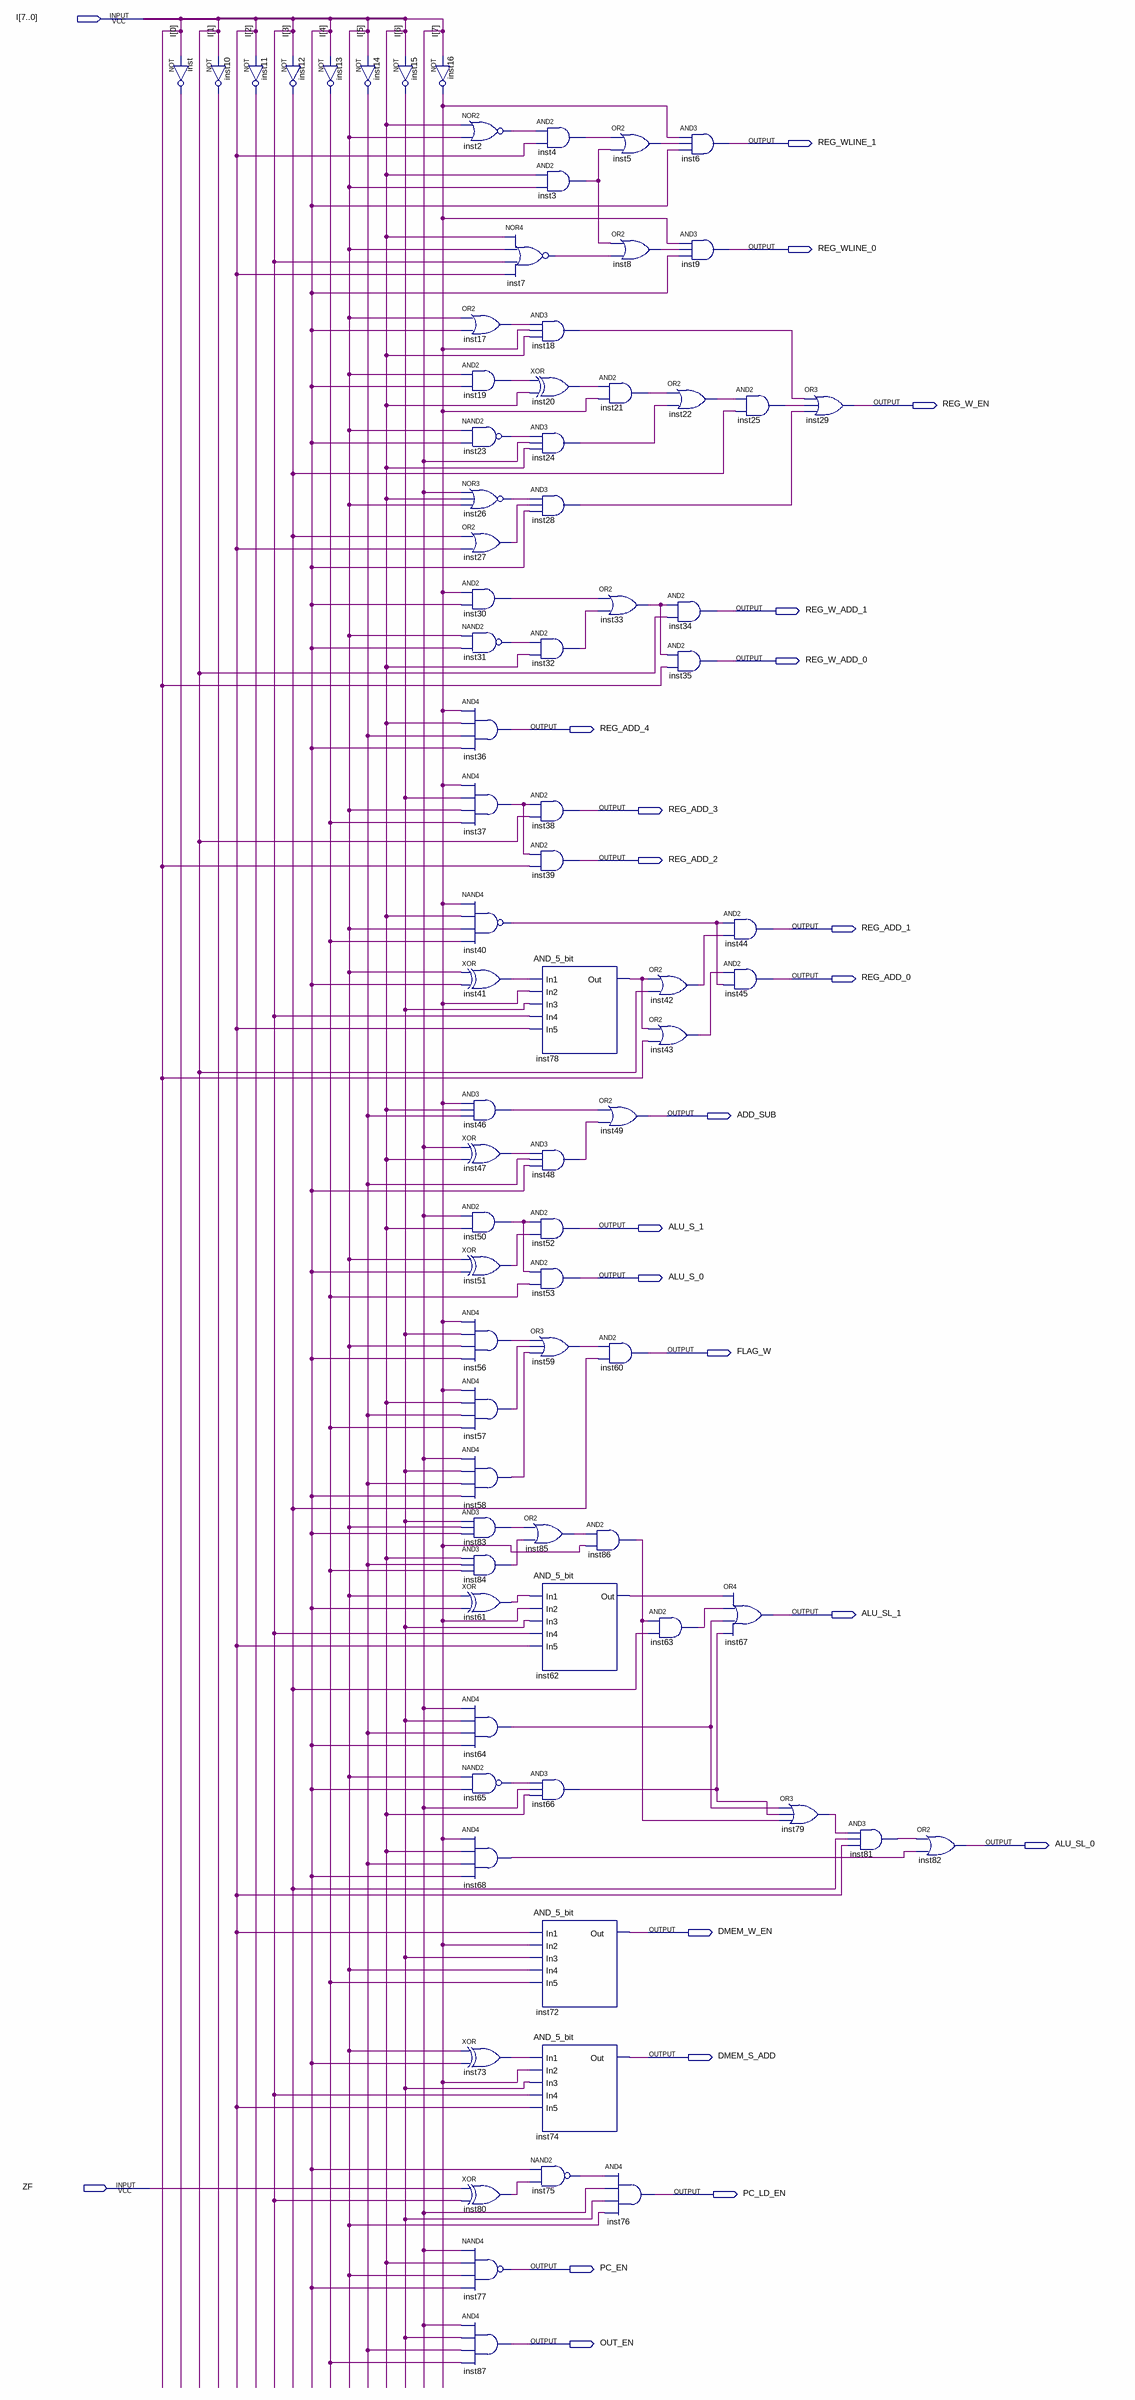
[diagram p0: schematic sheet]
// Quartus schematic Control.bdf as structural Verilog: 82 symbols, 23 pins
module Control (
  input  [7:0] I,
  input  ZF,
  output REG_WLINE_1,
  output REG_WLINE_0,
  output REG_W_EN,
  output REG_W_ADD_1,
  output REG_W_ADD_0,
  output REG_ADD_4,
  output REG_ADD_3,
  output REG_ADD_2,
  output REG_ADD_1,
  output REG_ADD_0,
  output ADD_SUB,
  output ALU_S_1,
  output ALU_S_0,
  output FLAG_W,
  output ALU_SL_1,
  output ALU_SL_0,
  output DMEM_W_EN,
  output DMEM_S_ADD,
  output PC_LD_EN,
  output PC_EN,
  output OUT_EN
);

  wire inst2_out, inst3_out, inst4_out, inst5_out, inst7_out, inst8_out, inst10_out, inst11_out, inst12_out,
       inst13_out, inst14_out, inst15_out, inst16_out, inst17_out, inst18_out, inst19_out, inst20_out,
       inst21_out, inst22_out, inst23_out, inst24_out, inst25_out, inst26_out, inst27_out, inst28_out,
       inst30_out, inst31_out, inst32_out, inst33_out, inst37_out, inst40_out, inst41_out, inst42_out,
       inst43_out, inst46_out, inst47_out, inst48_out, inst50_out, inst51_out, inst56_out, inst57_out,
       inst58_out, inst59_out, inst61_out, inst62_out, inst63_out, inst64_out, inst65_out, inst66_out,
       inst68_out, inst73_out, inst75_out, inst78_out, inst79_out, inst80_out, inst81_out, inst83_out,
       inst84_out, inst85_out, inst86_out, inst_out;

  not inst (inst_out, I[0]);
  not inst10 (inst10_out, I[1]);
  not inst11 (inst11_out, I[2]);
  not inst12 (inst12_out, I[3]);
  not inst13 (inst13_out, I[4]);
  not inst14 (inst14_out, I[5]);
  not inst15 (inst15_out, I[6]);
  not inst16 (inst16_out, I[7]);
  nor inst2 (inst2_out, I[6], I[5]);
  or inst17 (inst17_out, I[5], I[4]);
  and inst19 (inst19_out, I[5], I[4]);
  nand inst23 (inst23_out, I[5], I[4]);
  nor inst26 (inst26_out, I[7], I[6], I[5]);
  or inst27 (inst27_out, inst12_out, I[2]);
  and inst30 (inst30_out, inst16_out, I[4]);
  nand inst31 (inst31_out, I[5], I[4]);
  and inst36 (REG_ADD_4, inst16_out, I[6], inst14_out, I[4]);
  and inst37 (inst37_out, inst16_out, inst15_out, I[5], inst13_out);
  nand inst40 (inst40_out, inst16_out, I[6], I[5], inst13_out);
  xor inst41 (inst41_out, I[5], I[4]);
  and inst46 (inst46_out, inst16_out, I[6], inst14_out);
  xor inst47 (inst47_out, I[7], I[6]);
  and inst50 (inst50_out, I[7], I[6]);
  xor inst51 (inst51_out, I[5], I[4]);
  and inst56 (inst56_out, inst16_out, inst15_out, I[5], I[4]);
  and inst57 (inst57_out, inst16_out, I[6], inst14_out, inst13_out);
  and inst58 (inst58_out, I[7], inst15_out, inst14_out, I[4]);
  and inst83 (inst83_out, inst15_out, I[5], I[4]);
  and inst84 (inst84_out, I[6], inst14_out, inst13_out);
  xor inst61 (inst61_out, I[5], I[4]);
  and inst64 (inst64_out, I[7], inst15_out, inst14_out, I[4]);
  nand inst65 (inst65_out, I[5], I[4]);
  and inst68 (inst68_out, inst16_out, I[6], inst14_out, I[4]);
  xor inst73 (inst73_out, I[5], I[4]);
  xor inst80 (inst80_out, ZF, I[3]);
  nand inst77 (PC_EN, I[7], I[6], I[5], I[4]);
  and inst87 (OUT_EN, I[7], inst15_out, inst14_out, inst13_out);
  nor inst7 (inst7_out, I[6], I[5], I[3], I[2]);
  and inst4 (inst4_out, inst2_out, I[2]);
  and inst3 (inst3_out, I[6], I[5]);
  and inst18 (inst18_out, inst17_out, inst16_out, I[6]);
  xor inst20 (inst20_out, inst19_out, I[6]);
  and inst24 (inst24_out, inst23_out, I[7], I[6]);
  and inst28 (inst28_out, inst26_out, inst27_out, I[4]);
  and inst32 (inst32_out, inst31_out, I[6]);
  and inst38 (REG_ADD_3, inst37_out, I[1]);
  and inst39 (REG_ADD_2, inst37_out, I[0]);
  AND_5_bit inst78 (.In1(inst41_out), .In2(inst16_out), .In3(inst15_out), .In4(I[3]), .In5(I[2]), .Out(inst78_out));
  and inst48 (inst48_out, inst47_out, inst14_out, I[4]);
  and inst52 (ALU_S_1, inst50_out, inst51_out);
  and inst53 (ALU_S_0, inst50_out, inst13_out);
  or inst59 (inst59_out, inst56_out, inst57_out, inst58_out);
  or inst85 (inst85_out, inst83_out, inst84_out);
  AND_5_bit inst62 (.In1(inst61_out), .In2(inst16_out), .In3(inst15_out), .In4(I[3]), .In5(I[2]), .Out(inst62_out));
  and inst66 (inst66_out, inst65_out, I[7], I[6]);
  AND_5_bit inst72 (.In1(I[2]), .In2(inst16_out), .In3(inst15_out), .In4(I[5]), .In5(inst13_out), .Out(DMEM_W_EN));
  AND_5_bit inst74 (.In1(inst73_out), .In2(inst16_out), .In3(inst15_out), .In4(I[3]), .In5(I[2]), .Out(DMEM_S_ADD));
  nand inst75 (inst75_out, I[4], inst80_out);
  or inst5 (inst5_out, inst4_out, inst3_out);
  or inst8 (inst8_out, inst3_out, inst7_out);
  and inst21 (inst21_out, inst20_out, inst16_out);
  or inst33 (inst33_out, inst30_out, inst32_out);
  or inst49 (ADD_SUB, inst46_out, inst48_out);
  and inst60 (FLAG_W, inst59_out, inst12_out);
  and inst86 (inst86_out, inst85_out, inst16_out);
  and inst76 (PC_LD_EN, inst75_out, I[7], inst15_out, I[5]);
  or inst22 (inst22_out, inst21_out, inst24_out);
  and inst34 (REG_W_ADD_1, inst33_out, I[1]);
  and inst35 (REG_W_ADD_0, inst33_out, I[0]);
  or inst42 (inst42_out, inst78_out, I[1]);
  or inst43 (inst43_out, inst78_out, I[0]);
  and inst63 (inst63_out, inst86_out, inst12_out);
  and inst6 (REG_WLINE_1, inst16_out, inst5_out, I[4]);
  and inst9 (REG_WLINE_0, inst16_out, inst8_out, I[4]);
  and inst25 (inst25_out, inst22_out, inst12_out);
  and inst44 (REG_ADD_1, inst40_out, inst42_out);
  and inst45 (REG_ADD_0, inst43_out, inst40_out);
  or inst67 (ALU_SL_1, inst62_out, inst63_out, inst64_out, inst66_out);
  or inst29 (REG_W_EN, inst18_out, inst25_out, inst28_out);
  or inst79 (inst79_out, inst64_out, inst66_out, inst86_out);
  and inst81 (inst81_out, inst79_out, inst12_out, I[2]);
  or inst82 (ALU_SL_0, inst81_out, inst68_out);
endmodule
